# EAGLE design BrewPi Fuscus Board (EAGLE 7.3.0)
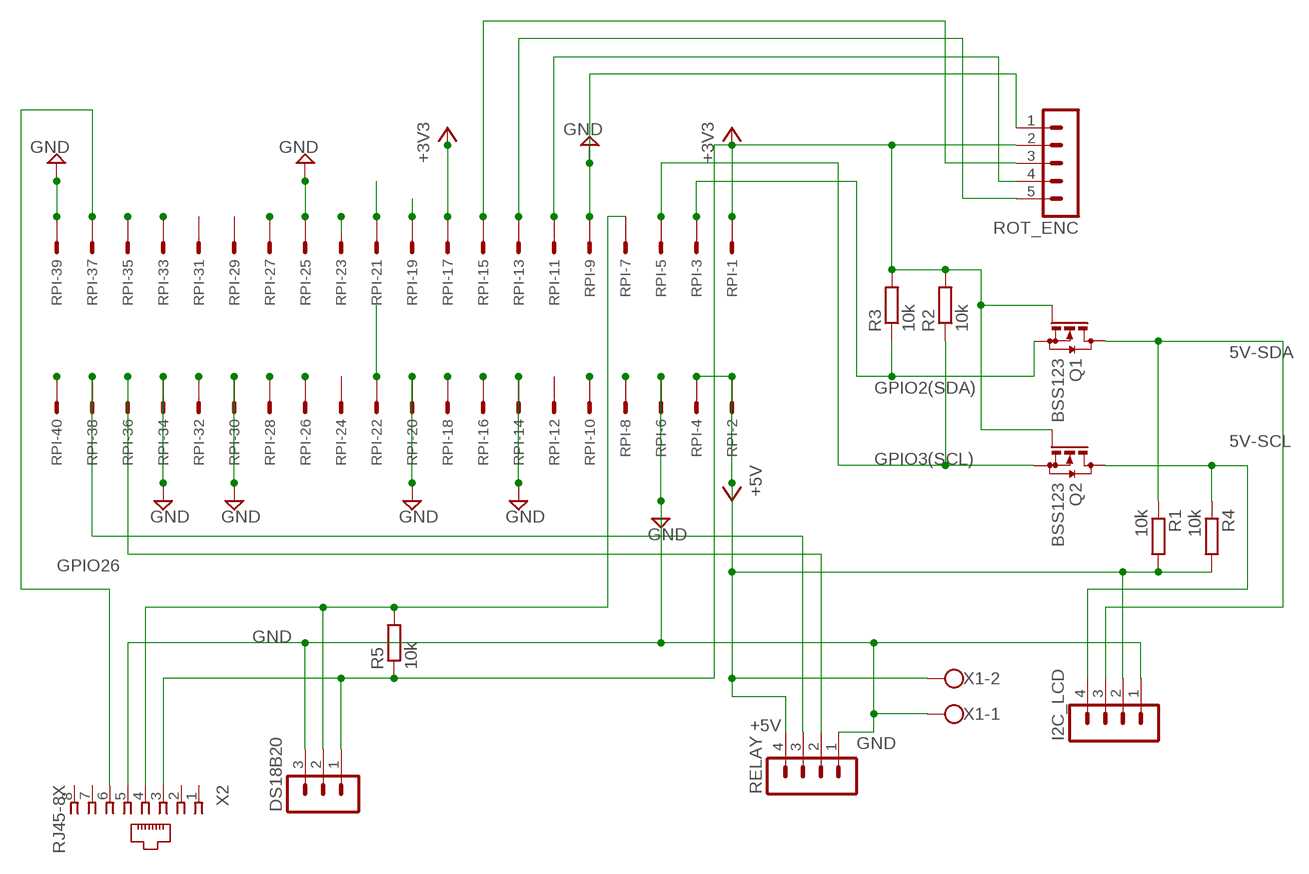
[diagram p0: schematic, sheet 1]

## Parts
DS18B20  MA03-1  [MA03-1]
I2C_LCD  MA04-1  [MA04-1]
Q1  BSS123  [SOT23]
Q2  BSS123  [SOT23]
R1  10k  R-EU_M1206  [M1206]
R2  10k  R-EU_M1206  [M1206]
R3  10k  R-EU_M1206  [M1206]
R4  10k  R-EU_M1206  [M1206]
R5  10k  R-EU_M1206  [M1206]
RELAY  MA04-1  [MA04-1]
ROT_ENC  MA05-1  [MA05-1]
RPI  057-040-1  [057-040-1]
X1  W237-102  [W237-102]
X2  RJ45-8X  [RJ45-NO-SHIELD]

## Nets
5V-SCL: I2C_LCD.4 Q2.3(D) R4.1
5V-SDA: I2C_LCD.3 Q1.3(D) R1.1
+3V3 [3v]: DS18B20.1 Q1.1(G) Q2.1(G) R2.2 R3.2 R5.1 ROT_ENC.2 RPI.1 RPI.17 X2.3
+5V [5v]: I2C_LCD.2 R1.2 R4.2 RELAY.4 RPI.2 RPI.4 X1.2
GND [ground]: DS18B20.3 I2C_LCD.1 RELAY.1 ROT_ENC.1 RPI.6 RPI.9 RPI.14 RPI.20 RPI.25 RPI.30 RPI.34 RPI.39 X1.1 X2.5
GPIO2(SDA): Q1.2(S) R3.1 RPI.3
GPIO3(SCL): Q2.2(S) R2.1 RPI.5
GPIO7(SPI_CE1_N): RPI.26
GPIO9(SPI_MISO): RPI.21
GPIO10(SPI_MOSI): RPI.19
GPIO11(SPI_SCLK): RPI.23
GPIO12: RPI.32
GPIO13: RPI.33
GPIO14(TXD0): RPI.8
GPIO15(RXD0): RPI.10
GPIO16: RELAY.2 RPI.36
GPIO17(GPIO_GEN0): ROT_ENC.4 RPI.11
GPIO19: RPI.35
GPIO20: RELAY.3 RPI.38
GPIO21: RPI.40
GPIO22(GPIO_GEN3): ROT_ENC.3 RPI.15
GPIO23(GPIO_GEN4): RPI.16
GPIO24(GPIO_GEN5): RPI.18
GPIO26: RPI.37 X2.6
GPIO27(GPIO_GEN2): ROT_ENC.5 RPI.13
ID_SC: RPI.28
ID_SD: RPI.27
N$1: DS18B20.2 R5.2 RPI.7 X2.4
RST: RPI.22
Unconnected: RPI.12 RPI.24 RPI.29 RPI.31 X2.1 X2.2 X2.7 X2.8

## Library data of the parts
DS18B20 = con-lstb:MA03-1: PIN HEADER; OC_FARNELL: unknown; OC_NEWARK: unknown
I2C_LCD RELAY = con-lstb:MA04-1: PIN HEADER; OC_FARNELL: unknown; OC_NEWARK: unknown
Q1 Q2 = transistor-small-signal:BSS123: N-CHANNEL MOS FET
R1-R5 = rcl:R-EU_: RESISTOR, European symbol
ROT_ENC = con-lstb:MA05-1: PIN HEADER; OC_FARNELL: unknown; OC_NEWARK: unknown
RPI = con-panduit:057-040-: CONNECTOR 40-pin series 057 contact pc board low profile headers; OC_FARNELL: unknown; OC_NEWARK: unknown
X1 = con-wago-500:W237-102: WAGO SCREW CLAMP; MPN: 237-102; OC_FARNELL: unknown; OC_NEWARK: 70K9898
X2 = con-tycoelectronics:RJ45: CORCOM Modular RJ Jacks No Shield Source: www.tycoelectronics.com .. ENG_DS_1654001_1099_RJ_L_0507.pdf; MPN: RJ45-8X; OC_FARNELL: unknown; OC_NEWARK: 16R6101

## Net classes
0 default: width 0.305 mm, drill 0.33 mm, clearance 0.305 mm
1 ground: width 0.457 mm, drill 0.33 mm, clearance 0.457 mm
2 5v: width 0.457 mm, drill 0.33 mm, clearance 0.457 mm
3 3v: width 0.356 mm, drill 0.33 mm, clearance 0.356 mm

## Board
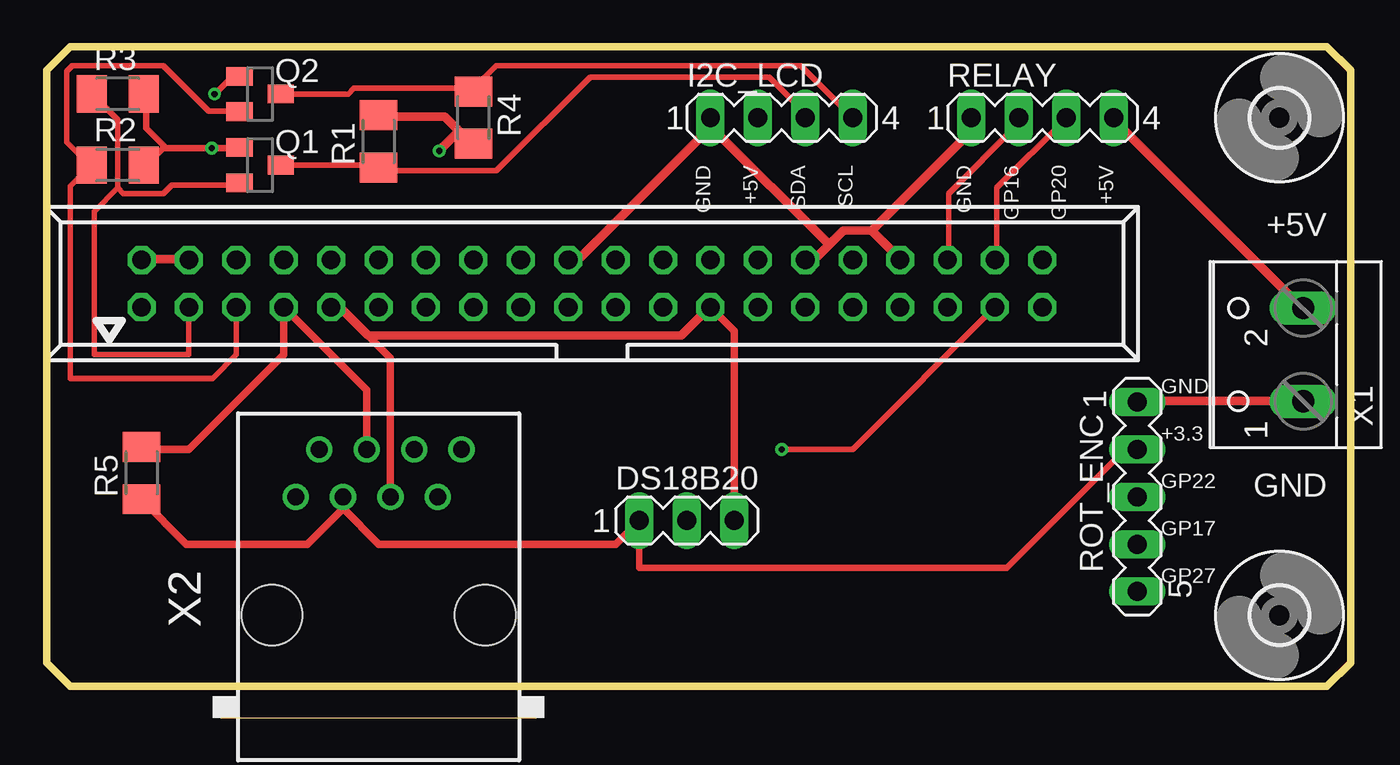
[diagram p1: board, top side]
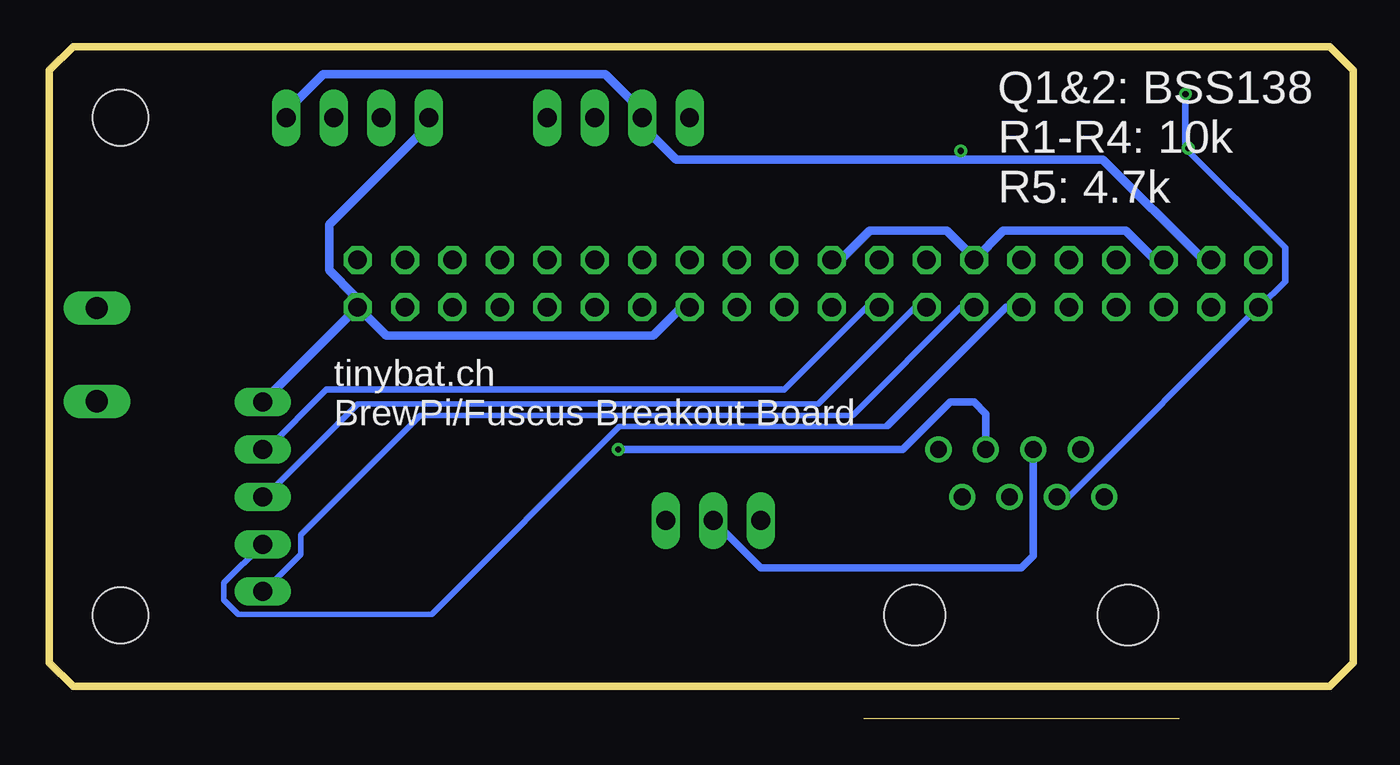
[diagram p2: board, bottom side, seen from below]

Size 69.85 x 34.29 mm. Coordinates in mm from the lower left corner, seen from the top.
Outline: 1.27,34.29 68.58,34.29 69.85,33.02 69.85,1.27 68.58,0 1.27,0 0,1.27 0,33.02 1.27,34.29
Copper layers (1*16): Top 0.0356mm / dielectric 1.5011mm / Bottom 0.0356mm
Design rules "PCBs_io": minimum track width 6mil, minimum drill 13mil, track to track 6mil, track to pad 6mil, pad to pad 6mil, via to via 6mil, smd to smd 6mil, copper to edge 15mil, drill to drill 6mil, minimum pad ring 7mil, minimum via ring 7mil, stop-mask expansion 3mil, vias tented up to drill 0mil, thermal gap 10mil

### Footprints (pad centres in the part's own frame; a part is rotated, then mirrored left to right if it is on the bottom)
MA03-1 = drill 1.016 long: 1 -2.54,0; 2 0,0; 3 2.54,0
MA04-1 = drill 1.016 long: 1 -3.81,0; 2 -1.27,0; 3 1.27,0; 4 3.81,0
SOT23 = smd 1 x 1.4: 1 -0.95,-1.1; 2 0.95,-1.1; 3 0,1.1
M1206 = smd 1.6 x 2: 1 -1.4,0; 2 1.4,0
MA05-1 = drill 1.016 long: 1 -5.08,0; 2 -2.54,0; 3 0,0; 4 2.54,0; 5 5.08,0
057-040-1 = drill 1 octagon: 1 -24.13,-1.27; 2 -24.13,1.27; 3 -21.59,-1.27; 4 -21.59,1.27; 5 -19.05,-1.27; 6 -19.05,1.27; 7 -16.51,-1.27; 8 -16.51,1.27; 9 -13.97,-1.27; 10 -13.97,1.27; 11 -11.43,-1.27; 12 -11.43,1.27; 13 -8.89,-1.27; 14 -8.89,1.27; 15 -6.35,-1.27; 16 -6.35,1.27; 17 -3.81,-1.27; 18 -3.81,1.27; 19 -1.27,-1.27; 20 -1.27,1.27; 21 1.27,-1.27; 22 1.27,1.27; 23 3.81,-1.27; 24 3.81,1.27; 25 6.35,-1.27; 26 6.35,1.27; 27 8.89,-1.27; 28 8.89,1.27; 29 11.43,-1.27; 30 11.43,1.27; 31 13.97,-1.27; 32 13.97,1.27; 33 16.51,-1.27; 34 16.51,1.27; 35 19.05,-1.27; 36 19.05,1.27; 37 21.59,-1.27; 38 21.59,1.27; 39 24.13,-1.27; 40 24.13,1.27
3,0 = hole 3: 0,0
W237-102 = drill 1.194 long: 1 -2.5,-1.27; 2 2.5,-1.27
RJ45-NO-SHIELD = drill 0.9 pad 1.4: 1 -4.445,6.35; 2 -3.175,8.89; 3 -1.905,6.35; 4 -0.635,8.89; 5 0.635,6.35; 6 1.905,8.89; 7 3.175,6.35; 8 4.445,8.89 | hole 3.251: -5.715,0; 5.715,0

### Placement (x,y rotation side)
DS18B20  34.29,8.89 0 top
I2C_LCD  39.37,30.48 0 top
Q1  11.43,27.94 270 top
Q2  11.43,31.75 270 top
R1  17.78,29.21 90 top
R2  3.81,27.94 0 top
R3  3.81,31.75 0 top
R4  22.86,30.48 270 top
R5  5.08,11.43 90 top
RELAY  53.34,30.48 0 top
ROT_ENC  58.42,10.16 270 top
RPI  29.21,21.59 0 top
U$3  [3,0]  66.04,30.48 0 top
U$4  [3,0]  66.04,3.81 0 top
X1  66.04,17.78 90 top
X2  17.78,3.81 0 top

### Tracks (layer width: path | path; a pad name or v marks a point on that pad's centre or on a via)
5V-SCL
  Top 0.305: Q2.3 16.15,31.75 16.46,32.05 22.71,32.05 22.86,31.9 R4.1 22.86,32.05 24.08,33.27 40.39,33.27 I2C_LCD.4
5V-SDA
  Top 0.305: Q1.3 17.68,27.94 R1.1 17.83,27.79 17.98,27.63 24.08,27.63 29.11,32.66 38.71,32.66 40.54,30.84 40.54,30.53 I2C_LCD.3
+3V3  (via drill 0.33)
  Top 0.356: 6.25,28.85 v8.84,28.85 10.21,28.85 Q1.1 | 6.25,28.85 5.33,27.94 R2.2 | R3.2 5.33,31.75 5.33,29.92 6.25,29.01 6.25,28.85 | v8.99,31.75 9.91,32.66 10.21,32.66 Q2.1 | DS18B20.1 31.75,6.35 51.43,6.35 57.79,12.7 ROT_ENC.2
  Top 0.406: 15.87,9.52 13.97,7.62 7.49,7.62 R5.1 | X2.3 15.87,9.52 | 15.87,9.52 17.78,7.62 30.48,7.62 DS18B20.1
  Bottom 0.356: RPI.17 26.06,20.32 30.48,15.9 55.02,15.9 58.22,12.7 ROT_ENC.2 | 8.99,28.85 v8.99,31.75 | 8.99,28.85 3.66,23.52 3.66,21.69 5.03,20.32 RPI.1 15.24,10.16 X2.3 | v8.84,28.85 8.99,28.85
+5V  (via drill 0.33)
  Top 0.457: R1.2 17.83,30.53 21.34,30.53 22.86,29.01 R4.2 21.95,29.62 v21.03,28.7 | RPI.2 5.18,22.91 7.62,22.91 RPI.4 | X1.2 67.21,20.32 57.15,30.38 RELAY.4
  Bottom 0.457: RELAY.4 57.15,30.84 55.17,32.82 40.08,32.82 38.1,30.84 I2C_LCD.2 37.95,30.38 37.95,29.92 36.27,28.24 21.03,28.24 | 21.03,28.24 13.41,28.24 8.08,22.91 7.62,22.91 RPI.4 | 21.03,28.24 v21.03,28.7
GND
  Top 0.406: X2.5 18.41,17.6 16.74,19.28 | DS18B20.3 36.83,19.05 RPI.25
  Top 0.457: X1.1 67.21,15.29 58.52,15.29 ROT_ENC.1 | 41.91,23.67 42.67,24.44 44.2,24.44 | 41.91,23.67 41.15,22.91 40.69,22.91 RPI.30 | 44.2,24.44 45.72,22.91 RPI.34 | 41.91,23.67 35.66,29.92 35.66,30.38 I2C_LCD.1 35.51,29.92 28.5,22.91 28.04,22.91 RPI.20 | RELAY.1 49.53,29.77 44.2,24.44 | RPI.9 15.7,20.32 16.74,19.28 17.22,18.8 33.98,18.8 35.51,20.32 RPI.25
  Bottom 0.457: RPI.25 35.97,20.32 37.49,18.8 51.82,18.8 RPI.39 | RPI.39 ROT_ENC.1 | RPI.6 10.21,22.91 10.67,22.91 12.19,24.44 18.74,24.44 RPI.14 20.42,23.06 21.79,24.44 25.91,24.44 27.43,22.91 27.89,22.91 RPI.20 | RELAY.1 49.53,30.07 54.86,24.74 54.86,22.3 53.49,20.93 53.49,20.47 RPI.39
GPIO2(SDA)
  Top 0.305: 3.81,26.72 4.12,26.42 6.25,26.42 6.71,26.87 10.21,26.87 Q1.2 | 3.81,26.72 3.81,30.38 2.44,31.75 R3.1 | RPI.3 7.62,17.78 2.54,17.78 2.54,25.45 3.81,26.72
GPIO3(SCL)
  Top 0.305: Q2.2 10.21,30.84 8.69,30.84 6.25,33.27 1.37,33.27 1.07,32.97 1.07,29.16 2.29,27.94 R2.1 1.27,26.8 1.27,16.51 8.89,16.51 10.16,17.78 RPI.5
GPIO16
  Top 0.305: RPI.36 48.31,22.91 48.31,26.42 51.97,30.07 51.97,30.38 RELAY.2
GPIO17(GPIO_GEN0)
  Bottom 0.305: 18.59,20.32 RPI.11 | ROT_ENC.4 60.5,5.54 60.5,4.62 59.74,3.86 49.38,3.86 39.32,13.92 24.99,13.92 24.94,13.97
  Bottom 0.406: 18.59,20.32 24.94,13.97
GPIO20
  Top 0.305: RPI.38 50.9,22.91 50.9,26.72 54.56,30.38 RELAY.3
GPIO22(GPIO_GEN3)
  Bottom 0.305: RPI.15 23.47,20.32 28.65,15.14 53.34,15.14 58.37,10.11 ROT_ENC.3
GPIO26  (via drill 0.33)
  Top 0.305: RPI.37 43.18,12.7 v39.37,12.7
  Bottom 0.406: X2.6 19.68,14.6 20.32,15.24 21.59,15.24 24.13,12.7 v39.37,12.7
GPIO27(GPIO_GEN2)
  Bottom 0.305: RPI.13 21.03,20.32 26.82,14.53 49.99,14.53 56.39,8.13 56.39,7.06 58.37,5.08 ROT_ENC.5
N$1
  Top 0.406: X2.4 17.14,15.88 RPI.7 12.7,17.78 7.62,12.7 5.21,12.7 R5.2
  Bottom 0.406: X2.4 17.14,6.98 17.78,6.35 31.75,6.35 DS18B20.2

### Text on the board
tPlace: GND | +5V | SDA | SCL | GND | GP16 | GP20 | +5V | +5V | GND | +3.3 | GP22 | GND | GP17 | GP27
bPlace: Q1&2: BSS138 / R1-R4: 10k / R5: 4.7k | tinybat.ch / BrewPi/Fuscus Breakout Board